# EAGLE design MFCC (EAGLE 7.6.0)
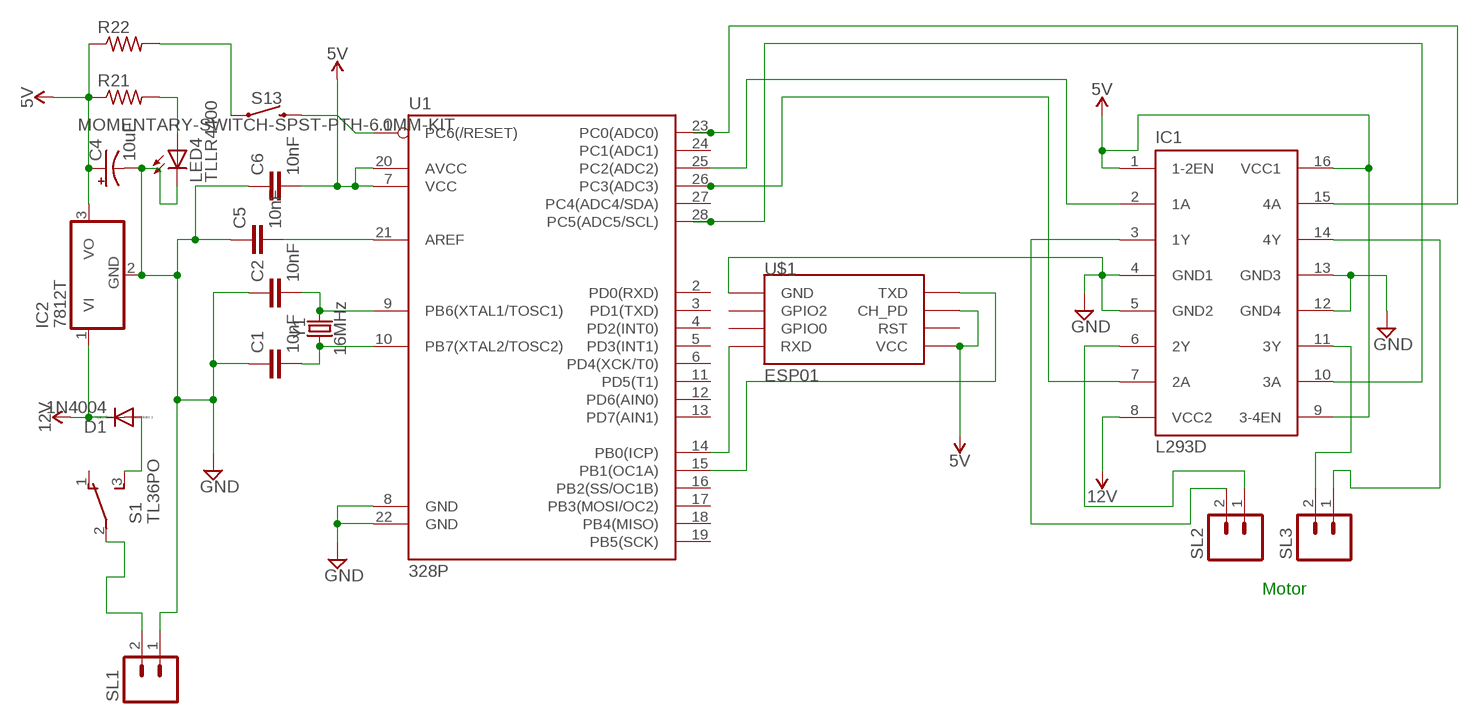
[diagram p0: schematic, sheet 1]

## Parts
C1  10nF  10NF-PTH-10MM-10000V-1-%  [CAP-PTH-10MM]
C2  10nF  10NF-PTH-10MM-10000V-1-%  [CAP-PTH-10MM]
C4  10uF  10UF-POLAR-RADIAL-2.5MM-KIT-25V-20%  [CPOL-RADIAL-2.5MM-5MM-KIT]
C5  10nF  10NF-PTH-10MM-10000V-1-%  [CAP-PTH-10MM]
C6  10nF  10NF-PTH-10MM-10000V-1-%  [CAP-PTH-10MM]
D1  1N4004  [DO41-10]
IC1  L293D  [DIL16]
IC2  7812T  [TO220H]
LED4  TLLR4400  [LED3MM]
R21  R-US_0207/12  [0207/12]
R22  R-US_0207/12  [0207/12]
S1  TL36PO  [TL3XPO]
S13  MOMENTARY-SWITCH-SPST-PTH-6.0MM-KIT  [TACTILE_SWITCH_PTH_6.0MM_KIT]
SL1  MA02  [02PA]
SL2  MA02  [02PA]
SL3  MA02  [02PA]
U1  328P  ATMEGA328P_PDIP  [DIP28]
U$1  ESP01  [ESP01]
Y1  16MHz  CRYSTAL-16MHZPTH-HC49US  [HC49US]

## Nets
5V: C4.1(+) C6.2 IC1.1(1-2EN) IC1.9(3-4EN) IC1.16(VCC1) IC2.3(VO) R21.1 R22.1 U1.7(VCC) U1.20(AVCC) U$1.CH_PD U$1.VCC
12V: D1.C IC1.8(VCC2) IC2.1(VI)
GND: C1.1 C2.1 C4.2(-) C5.1 C6.1 IC1.4(GND1) IC1.5(GND2) IC1.12(GND4) IC1.13(GND3) IC2.2(GND) LED4.K(C) SL1.1 U1.8(GND) U1.22(GND) U$1.GND
N$1: C5.2 U1.21(AREF)
N$2: S1.2(P) SL1.2
N$3: C2.2 U1.9(PB6(XTAL1/TOSC1)) Y1.2
N$4: C1.2 U1.10(PB7(XTAL2/TOSC2)) Y1.1
N$5: LED4.A R21.2
N$6: D1.A S1.3(S)
N$7: IC1.3(1Y) SL2.2
N$8: R22.2 S13.1
N$9: S13.3 U1.1(PC6(/RESET))
N$10: U1.15(PB1(OC1A)) U$1.TX(TXD)
N$11: U1.14(PB0(ICP)) U$1.RX(RXD)
N$13: IC1.2(1A) U1.25(PC2(ADC2))
N$14: IC1.7(2A) U1.26(PC3(ADC3))
N$15: IC1.10(3A) U1.28(PC5(ADC5/SCL))
N$16: IC1.15(4A) U1.23(PC0(ADC0))
N$31: IC1.14(4Y) SL3.1
N$33: IC1.6(2Y) SL2.1
N$34: IC1.11(3Y) SL3.2
Unconnected: S1.1(O) U1.2(PD0(RXD)) U1.3(PD1(TXD)) U1.4(PD2(INT0)) U1.5(PD3(INT1)) U1.6(PD4(XCK/T0)) U1.11(PD5(T1)) U1.12(PD6(AIN0)) U1.13(PD7(AIN1)) U1.16(PB2(SS/OC1B)) U1.17(PB3(MOSI/OC2)) U1.18(PB4(MISO)) U1.19(PB5(SCK)) U1.24(PC1(ADC1)) U1.27(PC4(ADC4/SDA)) U$1.GPIO0 U$1.GPIO2 U$1.RST

## Notes on the sheet
- Motor

## Library data of the parts
C1 C2 C5 C6 = SparkFun-Capacitors:10NF: 0.01uF/10nF/10,000pF ceramic capacitors A capacitor is a passive two-terminal electrical component used to store electrical energy temporarily in an electric field. CAP-09321; PROD_ID: CAP-09321
C4 = SparkFun-Capacitors:10UF-POLAR: 10.0µF polarized capacitors A capacitor is a passive two-terminal electrical component used to store electrical energy temporarily in an electric field.; PROD_ID: CAP-08440
D1 = diode:1N4004: DIODE general purpose rectifier, 1 A
IC1 = st-microelectronics:L293D: PUSH-PULL 4 CHANNEL DRIVER; MPN: L293D; OC_FARNELL: 9589619; OC_NEWARK: 56P8249
IC2 = linear:78*: Positive VOLTAGE REGULATOR Source: http://cache.national.com/ds/LM/LM78L05.pdf http://www.fairchildsemi.com/ds/LM/LM7805.pdf
LED4 = led:TLLR4400: Low Current (2mA) LED 3 mm Tinted Diffused Package color RED Source: Data sheet <http://www.farnell.com/datasheets/391100.pdf>; MF: VISHAY SEMICONDUCTOR; OC_FARNELL: 1612437
R21 R22 = rcl:R-US_: RESISTOR, American symbol
S1 = switch:TL36PO: TINY SWITCH ON - ON Source: http://www2.produktinfo.conrad.com/datenblaetter/700000-724999/705152-da-01-de-Subminiaturschalter_TL_36YO.pdf
S13 = SparkFun-Switches:MOMENTARY-SWITCH-SPST: Momentary Switch (Pushbutton) - SPST Normally-open (NO) SPST momentary switches (buttons, pushbuttons). Variants PTH-12MM - 12mm square, through-hole Momentary Pushbutton Switch - 12mm Square <https://www.sparkfun.com/products/9190> (COM-09190) PTH-6.0MM, PTH-6.0MM-KIT - 6.0mm square, through-hole Mini Pushbutton Switch <https://www.sparkfun.com/products/97> (COM-00097) KIT package intended for soldering kit's - only one side of pads' copper is exposed. PTH-RIGHT-ANGLE-KIT - Right-angle, through-hole Right Angle Tactile Button <https://www.sparkfun.com/products/10791> - Used on SparkFun BigTime Watch Kit <https://www.sparkfun.com/products/11734> SMD-12MM - 12mm square, surface-mount Tactile Button - SMD (12mm) <https://www.sparkfun.com/products/12993> (COM-12993) Used on SparkFun PicoBoard <https://www.sparkfun.com/products/11888> SMD-4.5MM - 4.5mm Square Trackball Switch Used on SparkFun Blackberry Trackballer Breakout <https://www.sparkfun.com/products/13169> SMD-4.6MMX2.8MM - 4.60mm x 2.80mm, surface mount Used on SparkFun SAMD21 Mini Breakout <https://www.sparkfun.com/products/13664> SMD-5.2MM, SMD-5.2-REDUNDANT - 5.2mm square, surface-mount Mini Pushbutton Switch - SMD <https://www.sparkfun.com/products/8720> (COM-08720) Used on Arduino Pro Mini <https://www.sparkfun.com/products/11114> REDUNDANT package connects both switch circuits together SMD-6.0X3.5MM - 6.0 x 3.5mm, surface mount Momentary Reset Switch SMD <https://www.sparkfun.com/products/8229> (COM-08229) SMD-6.2MM-TALL - 6.2mm square, surface mount Tactile Button - SMD (6mm) <https://www.sparkfun.com/products/12992> Used on SparkFun Digital Sandbox <https://www.sparkfun.com/products/12651> SMD-RIGHT-ANGLE - Right-angle, surface mount Used on SparkFun Block for Intel® Edison - Arduino <https://www.sparkfun.com/products/13036>; PROD_ID: SWCH-08441; SF_SKU: COM-00097
SL1-SL3 = con-amp-quick:MA02: AMP QUICK CONNECTOR; OC_FARNELL: unknown; OC_NEWARK: unknown
U1 = SparkFun-IC-Microcontroller:ATMEGA328P_PDIP: Atmel 328P Through hole ATMEGA328P uC used in the Arduino 32kb flash, 1k EEPROM, 2k SRAM Datasheet <http://www.sparkfun.com/datasheets/Components/SMD/ATMega328.pdf> SparkFun Products Storefront component: AVR 28 Pin 20MHz 32K 6A/D - ATMega328P <https://www.sparkfun.com/products/9061> (COM-09061) SparkFun Simon Says - Through-Hole Soldering Kit <https://www.sparkfun.com/products/10547> (KIT-10547) SparkFun Learn to Solder - Simon Says <https://www.sparkfun.com/products/13708> (KIT-13708) SparkFun BigTime Watch Kit <https://www.sparkfun.com/products/11734> (KIT-11734) SparkFun ClockIt <https://www.sparkfun.com/products/10930> (KIT-10930) SparkFun Serial Enabled LCD Kit <https://www.sparkfun.com/products/10097> (LCD-10097) SparkFun Simon Tilts - Through Hole Soldering Kit <https://www.sparkfun.com/products/12634> (KIT-12634) SparkFun Frequency Counter Kit <https://www.sparkfun.com/products/10140> (KIT-10140) FabFM Radio Kit <https://www.sparkfun.com/products/11043> (KIT-11043) SparkFun Binary Blaster Kit <https://www.sparkfun.com/products/12037> (KIT-12037) SparkFun Metro-Gnome <https://www.sparkfun.com/products/9236> (KIT-09236) ATmega328 with Arduino Optiboot (Uno) <https://www.sparkfun.com/products/10524> (DEV-10524); PROD_ID: IC-09136
U$1 = esp8266modules:ESP01: ESP8266 Wifi module 01
Y1 = SparkFun-Clocks:CRYSTAL-16MHZ: 16MHz Crystal Digikey Example <http://www.digikey.com/product-search/en?keywords=535-9122-1-ND> Frequency: 16MHz Frequency Stability: ±50ppm Frequency Tolerance: ±20ppm Load Capacitance: 18pF SparkFun Products: Pro Micro -5V/16MHz <https://www.sparkfun.com/products/12640> SparkFun Serial Enabled LCD Kit <https://www.sparkfun.com/products/10097>; PROD_ID: XTAL-08181; SF_ID: COM-00536

## Board
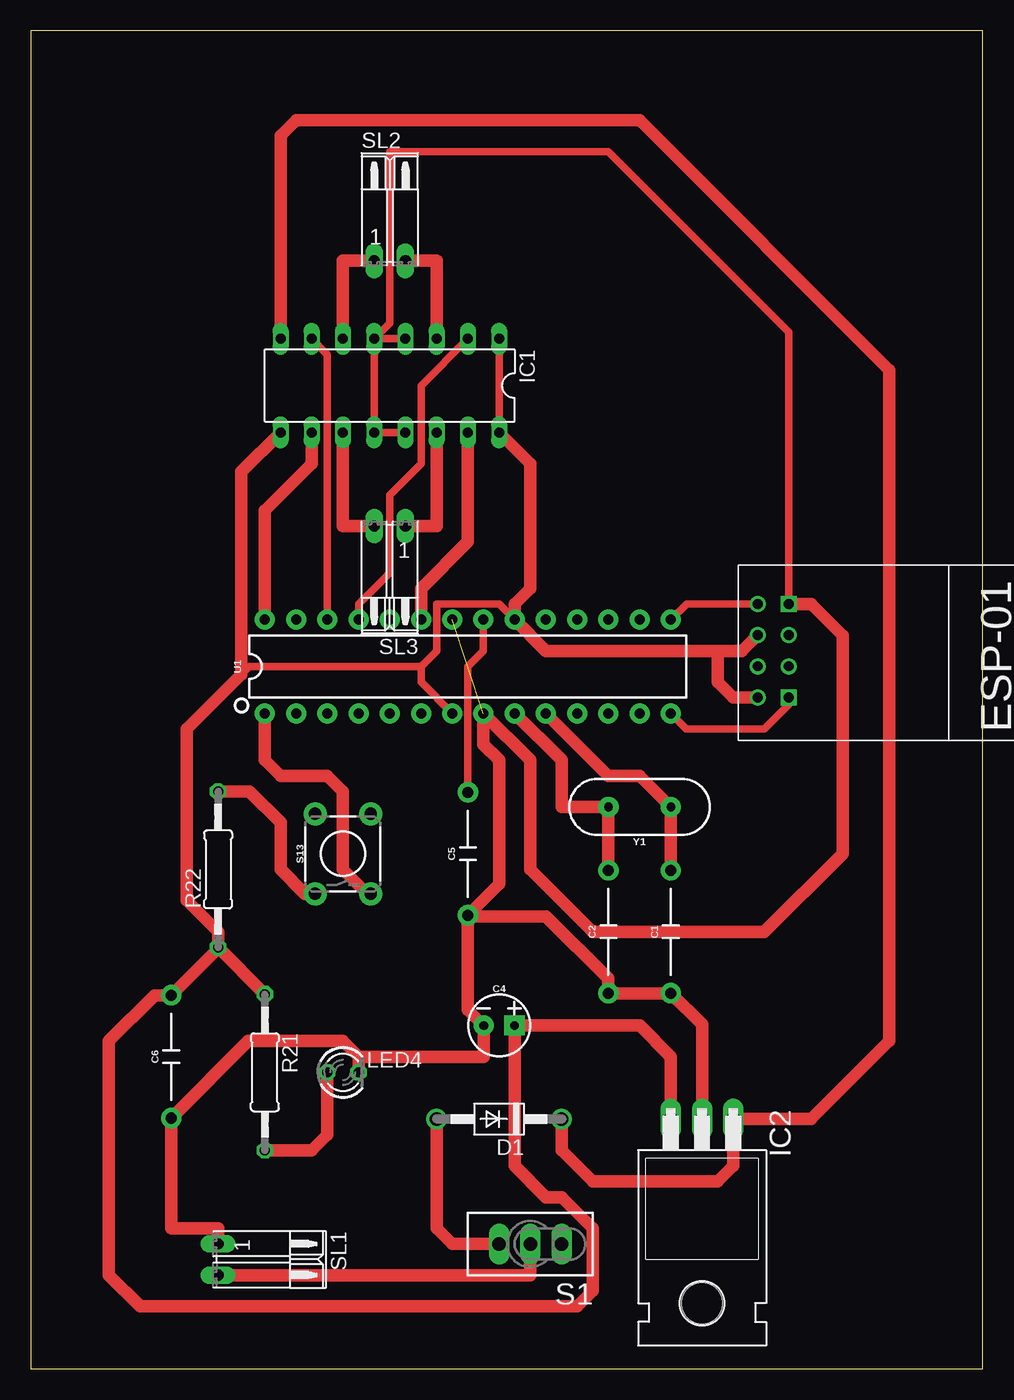
[diagram p1: board, top side]
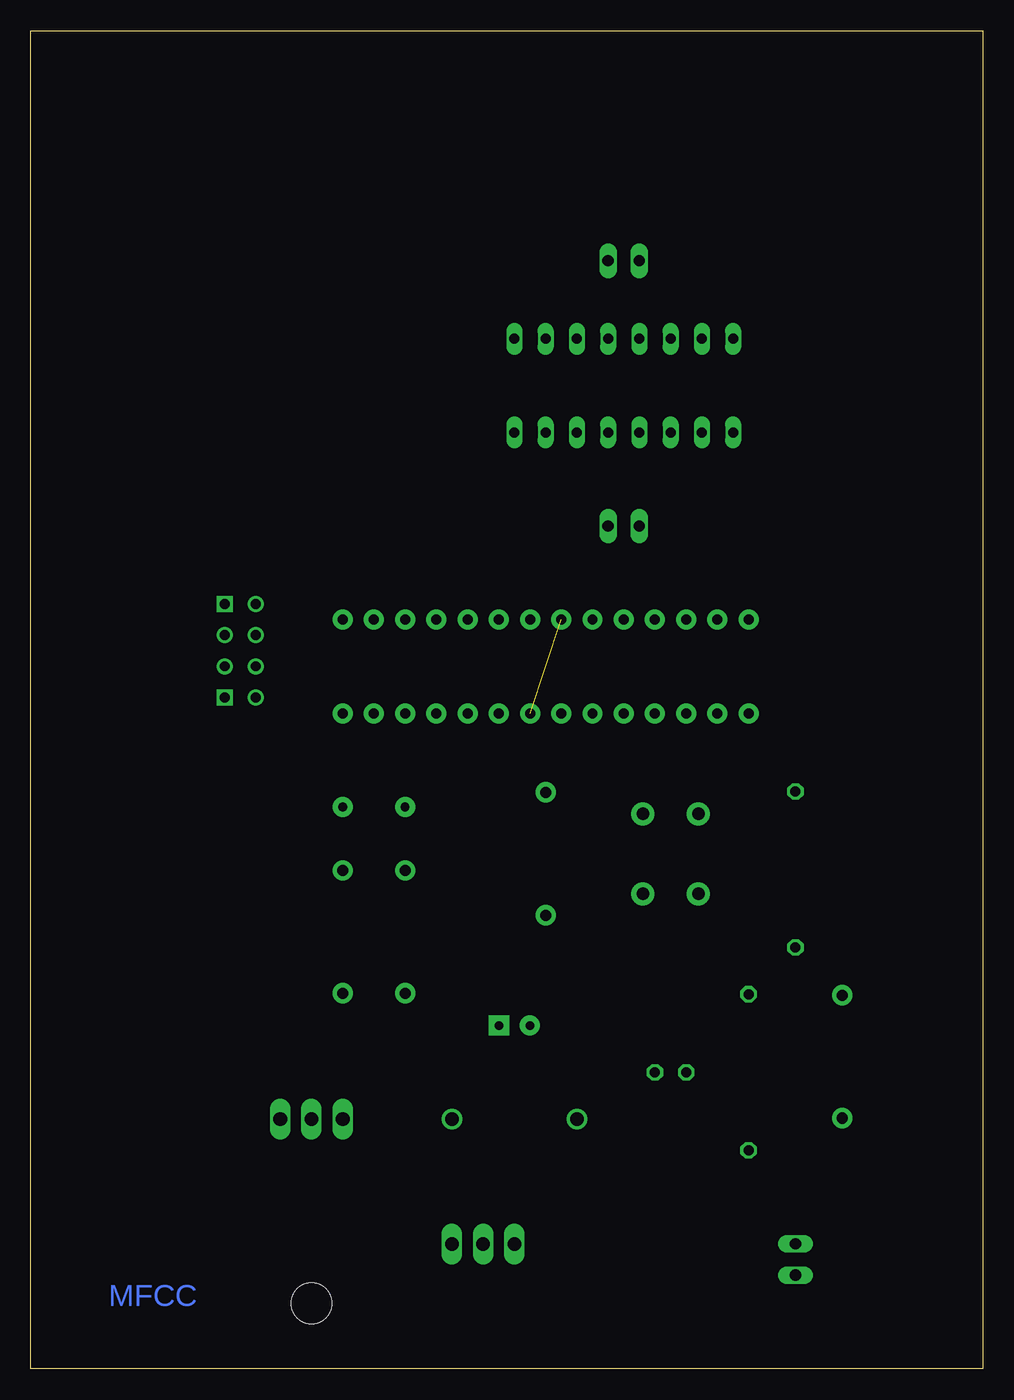
[diagram p2: board, bottom side, seen from below]

Size 77.45 x 108.89 mm. Coordinates in mm from the lower left corner, seen from the top.
Outline: 0,0 77.45,0 77.45,108.89 0,108.89 0,0
Copper layers (1*16): Top 0.035mm / dielectric 1.5mm / Bottom 0.035mm
Design rules "default": minimum track width 10mil, minimum drill 24mil, track to track 8mil, track to pad 8mil, pad to pad 8mil, via to via 8mil, smd to smd 8mil, copper to edge 40mil, drill to drill 8mil, minimum pad ring 10mil, minimum via ring 8mil, stop-mask expansion 4mil, vias tented up to drill 0mil, thermal gap 10mil

### Footprints (pad centres in the part's own frame; a part is rotated, then mirrored left to right if it is on the bottom)
CAP-PTH-10MM = drill 0.9 pad 1.651: 1 -5,0; 2 5,0
CPOL-RADIAL-2.5MM-5MM-KIT = drill 0.7 pad 1.651 square: 1 1.25,0 | drill 0.7 pad 1.651: 2 -1.25,0
DO41-10 = drill 1.118: A 5.08,0; C -5.08,0
DIL16 = drill 0.813 long: 1 -8.89,-3.81; 2 -6.35,-3.81; 3 -3.81,-3.81; 4 -1.27,-3.81; 5 1.27,-3.81; 6 3.81,-3.81; 7 6.35,-3.81; 8 8.89,-3.81; 9 8.89,3.81; 10 6.35,3.81; 11 3.81,3.81; 12 1.27,3.81; 13 -1.27,3.81; 14 -3.81,3.81; 15 -6.35,3.81; 16 -8.89,3.81
TO220H = drill 1.118 long: 1 -2.54,-10.16; 2 0,-10.16; 3 2.54,-10.16 | hole 3.302: 0,4.826
LED3MM = drill 0.813 octagon: A -1.27,0; K 1.27,0
0207/12 = drill 0.813 octagon: 1 -6.35,0; 2 6.35,0
TL3XPO = drill 1.1 pad 1.422 long: 1 -2.54,0; 2 0,0; 3 2.54,0
TACTILE_SWITCH_PTH_6.0MM_KIT = drill 1.016 pad 1.88: 1 -3.251,2.261; 2 3.251,2.261; 3 -3.251,-2.261; 4 3.251,-2.261
02PA = drill 0.914 long: 1 -1.27,0; 2 1.27,0
DIP28 = drill 0.813 pad 1.626: 1 -16.51,-3.81; 2 -13.97,-3.81; 3 -11.43,-3.81; 4 -8.89,-3.81; 5 -6.35,-3.81; 6 -3.81,-3.81; 7 -1.27,-3.81; 8 1.27,-3.81; 9 3.81,-3.81; 10 6.35,-3.81; 11 8.89,-3.81; 12 11.43,-3.81; 13 13.97,-3.81; 14 16.51,-3.81; 15 16.51,3.81; 16 13.97,3.81; 17 11.43,3.81; 18 8.89,3.81; 19 6.35,3.81; 20 3.81,3.81; 21 1.27,3.81; 22 -1.27,3.81; 23 -3.81,3.81; 24 -6.35,3.81; 25 -8.89,3.81; 26 -11.43,3.81; 27 -13.97,3.81; 28 -16.51,3.81
ESP01 = drill 0.8: CH_PD -1.285,-8.178; GPIO0 1.255,-5.638; GPIO2 -1.285,-5.638; RST 1.255,-8.178; TX -3.825,-8.178; VCC 3.795,-8.178 | drill 0.8 square: GND -3.825,-5.638; RX 3.795,-5.638
HC49US = drill 0.7 pad 1.651: 1 -2.54,0; 2 2.54,0

### Placement (x,y rotation side)
C1  52.07,35.56 90 top
C2  46.99,35.56 90 top
C4  38.1,27.94 0 top
C5  35.56,41.91 90 top
C6  11.43,25.4 90 top
D1  38.1,20.32 180 top
IC1  29.21,80.01 180 top
IC2  54.61,10.16 180 top
LED4  25.4,24.13 0 top
R21  19.05,24.13 270 top
R22  15.24,40.64 90 top
S1  40.64,10.16 180 top
S13  25.4,41.91 90 top
SL1  15.24,8.89 270 top
SL2  29.21,90.17 0 top
SL3  29.21,68.58 180 top
U1  35.56,57.15 0 top
U$1  67.31,58.42 270 top
Y1  49.53,45.72 180 top

### Tracks (layer width: path | path; a pad name or v marks a point on that pad's centre or on a via)
5V
  Top 0.61: IC1.1 IC1.16 | U1.20 38.1,62.23 33.02,62.23 33.02,58.42 31.75,57.15 | 31.75,57.15 17.78,57.15 17.14,56.52 | U1.7 31.75,55.88 31.75,57.15
  Top 1.016: IC2.3 52.07,25.4 49.53,27.94 C4.1 39.37,27.92 39.37,16.51 41.91,13.97 43.18,13.97 45.72,11.43 45.72,6.35 44.45,5.08 8.89,5.08 6.35,7.62 6.35,26.67 10.08,30.4 C6.2 15.24,34.21 R22.1 | R21.1 R22.1 | U$1.CH_PD 57.85,58.42 55.88,58.42 | 55.88,58.42 41.91,58.42 U1.20 39.37,62.23 40.64,63.5 40.64,73.66 IC1.16 | IC1.9 17.14,73.03 17.14,56.52 12.7,52.07 12.7,38.1 15.24,35.56 R22.1 | U$1.VCC 59.12,54.61 57.15,54.61 55.88,55.88 55.88,58.42
12V
  Top 1.016: D1.C 43.18,17.78 45.72,15.24 55.88,15.24 57.15,16.51 IC2.1 63.5,20.32 69.85,26.67 69.85,81.28 49.53,101.6 21.59,101.6 20.32,100.33 IC1.8
GND  (1 unrouted)
  Top 0.61: IC1.5 IC1.12 IC1.13 | IC1.4 IC1.5 | IC1.5 29.21,85.09 29.21,99.06 46.99,99.06 61.67,84.38 U$1.GND
  Top 1.016: IC2.2 54.61,28.02 C1.1 C2.1 46.99,31.75 41.91,36.83 35.64,36.83 C5.1 | 26.67,25.4 25.4,26.67 17.7,26.67 C6.1 11.43,11.43 15.24,11.43 SL1.1 | 26.67,25.4 LED4.K | C5.1 35.56,29.21 36.83,27.94 C4.2 36.85,25.4 26.67,25.4 | C5.1 38.1,39.45 38.1,49.53 36.83,50.8 U1.8 40.64,49.53 40.64,40.64 45.72,35.56 59.69,35.56 66.04,41.91 66.04,59.69 63.48,62.24 U$1.GND
N$1
  Top 0.61: C5.2 35.56,57.15 36.83,58.42 U1.21
N$2
  Top 1.016: S1.2 40.64,7.62 SL1.2
N$3
  Top 1.016: C2.2 Y1.2 43.18,45.72 43.18,49.53 U1.9
N$4
  Top 1.016: C1.2 Y1.1 49.53,48.26 46.99,48.26 U1.10
N$5
  Top 1.016: LED4.A 24.13,19.05 22.86,17.78 R21.2
N$6
  Top 1.016: D1.A 33.02,11.43 34.29,10.16 S1.3
N$7
  Top 1.016: SL2.2 33.02,90.17 IC1.3
N$8
  Top 1.016: R22.2 17.78,46.99 20.32,44.45 20.32,40.64 22.3,38.66 S13.1
N$9
  Top 1.016: U1.1 19.05,49.53 20.32,48.26 24.13,48.26 25.4,46.99 25.4,40.64 27.38,38.66 S13.3
N$10
  Top 0.61: U1.15 53.36,62.24 U$1.TX
N$11
  Top 0.61: U1.14 53.34,52.07 59.69,52.07 61.67,54.05 U$1.RX
N$13
  Top 0.61: IC1.2 31.75,80.01 31.75,73.66 29.21,71.12 29.21,64.77 26.67,62.23 U1.25
N$14
  Top 0.61: IC1.7 24.13,82.55 U1.26
N$15
  Top 1.016: IC1.10 22.86,73.66 19.05,69.85 U1.28
N$16
  Top 1.016: IC1.15 35.56,67.31 31.75,63.5 U1.23
N$31
  Top 1.016: IC1.14 33.02,68.58 SL3.1
N$33
  Top 1.016: SL2.1 25.4,90.17 IC1.6
N$34
  Top 1.016: IC1.11 25.4,68.58 SL3.2

### Text on the board
Bottom: MFCC